# Altium schematic sheet UI_BUTTON_LED.SchDoc
size 297 x 209 mm
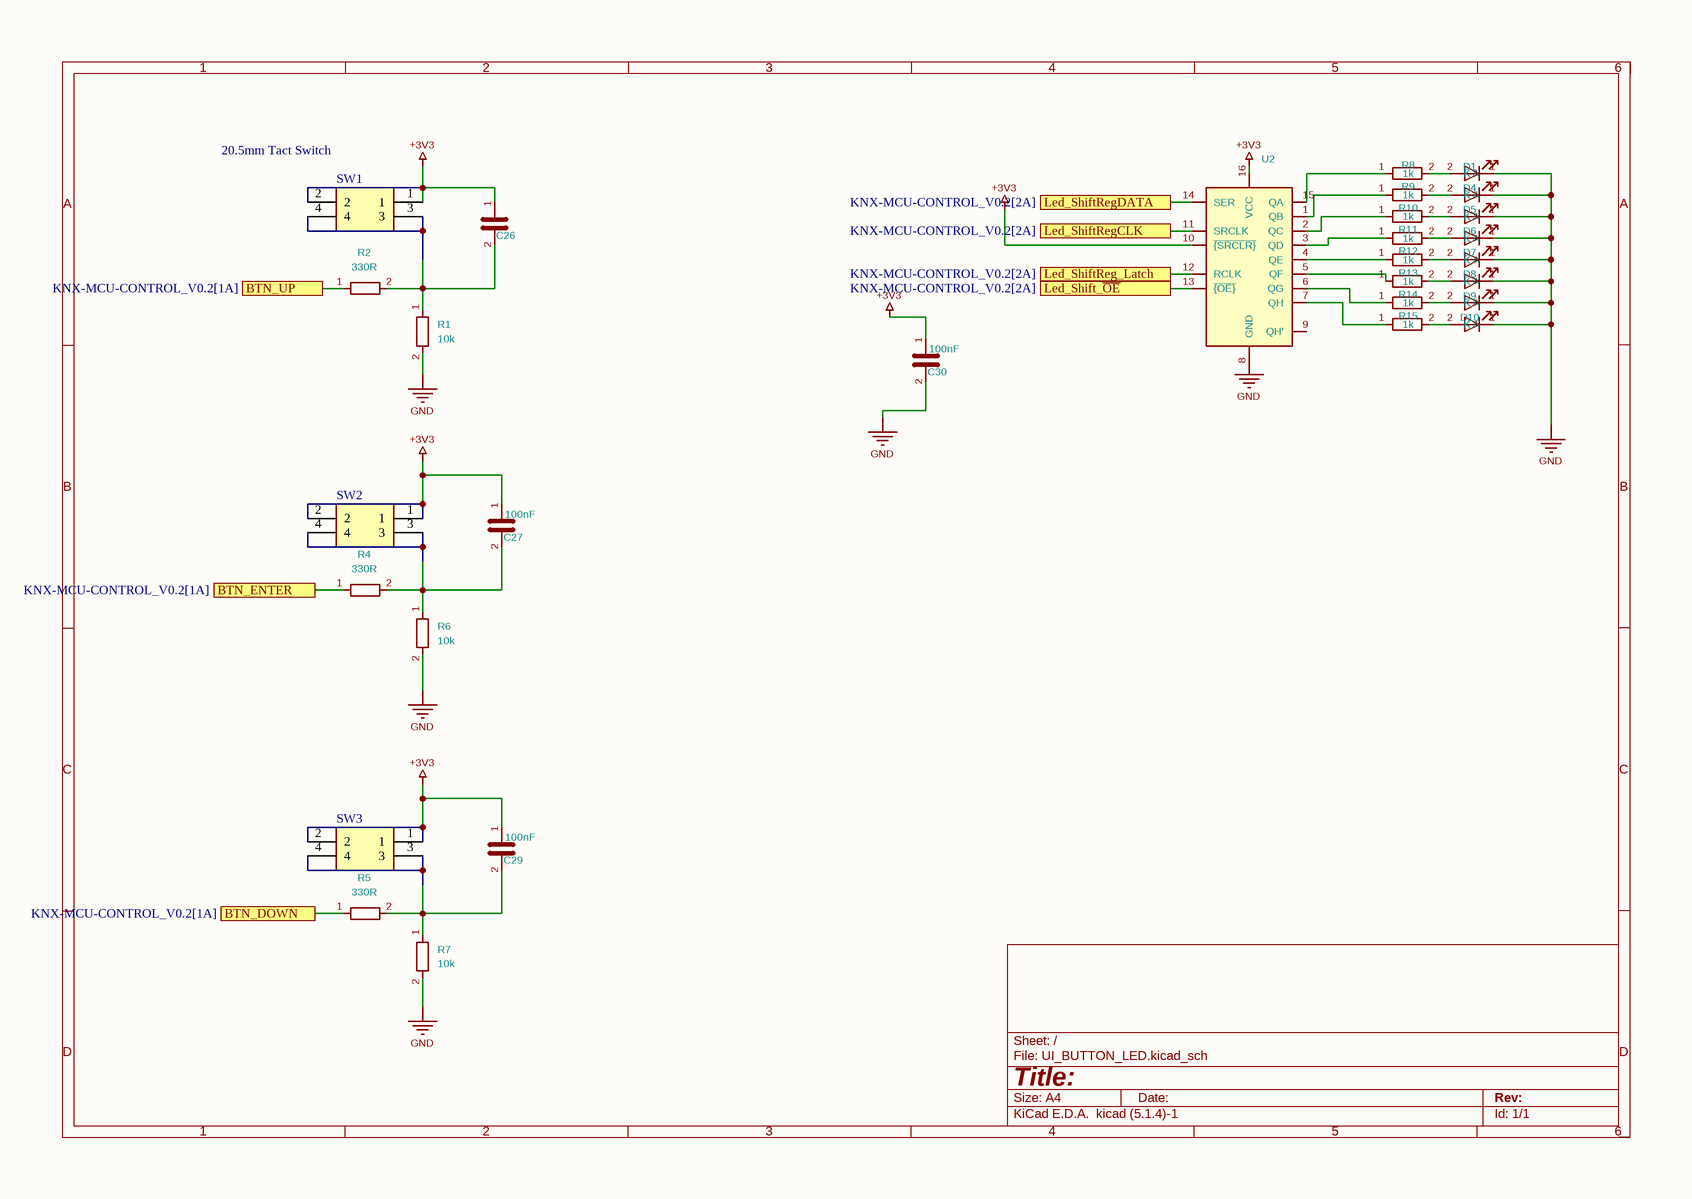
[diagram p0: UI_BUTTON_LED.SchDoc]

## Parts
C26  100nF  [C_0603_1608Metric]  (value not drawn)
C27  100nF  [C_0603_1608Metric]
C29  100nF  [C_0603_1608Metric]
C30  100nF  [C_0603_1608Metric]
D1  LED  [LED_0603_1608Metric]  (value not drawn)
D4  LED  [LED_0603_1608Metric]  (value not drawn)
D5  LED  [LED_0603_1608Metric]  (value not drawn)
D6  LED  [LED_0603_1608Metric]  (value not drawn)
D7  LED  [LED_0603_1608Metric]  (value not drawn)
D8  LED  [LED_0603_1608Metric]  (value not drawn)
D9  LED  [LED_0603_1608Metric]  (value not drawn)
D10  LED  [LED_0603_1608Metric]  (value not drawn)
R1  10k  [R_0603_1608Metric]
R2  330R  [R_0603_1608Metric]
R4  330R  [R_0603_1608Metric]
R5  330R  [R_0603_1608Metric]
R6  10k  [R_0603_1608Metric]
R7  10k  [R_0603_1608Metric]
R8  1k  [R_0603_1608Metric]
R9  1k  [R_0603_1608Metric]
R10  1k  [R_0603_1608Metric]
R11  1k  [R_0603_1608Metric]
R12  1k  [R_0603_1608Metric]
R13  1k  [R_0603_1608Metric]
R14  1k  [R_0603_1608Metric]
R15  1k  [R_0603_1608Metric]
SW1  TSA06141-225B532CA-3C00  [TL1105]  (value not drawn)
SW2  TSA06141-225B532CA-3C00  [TL1105]  (value not drawn)
SW3  TSA06141-225B532CA-3C00  [TL1105]  (value not drawn)
U2  74HC595PW,118  [TSSOP-16_4.4x5mm_P0.65mm]  (value not drawn)

## Ports
BTN_DOWN (see KNX-MCU-CONTROL_V0.2[1A]), BTN_ENTER (see KNX-MCU-CONTROL_V0.2[1A]), BTN_UP (see KNX-MCU-CONTROL_V0.2[1A]), Led_Shift_~{OE} (see KNX-MCU-CONTROL_V0.2[2A]), Led_ShiftReg_Latch (see KNX-MCU-CONTROL_V0.2[2A]), Led_ShiftRegCLK (see KNX-MCU-CONTROL_V0.2[2A]), Led_ShiftRegDATA (see KNX-MCU-CONTROL_V0.2[2A])

## Nets
+3V3: C26.1 C27.1 C29.1 C30.1 SW1.1 SW1.2 SW2.1 SW2.2 SW3.1 SW3.2 U2.10(~{{SRCLR}}) U2.16(VCC)
GND: C30.2 D1.1(K) D4.1(K) D5.1(K) D6.1(K) D7.1(K) D8.1(K) D9.1(K) D10.1(K) R1.2 R6.2 R7.2 U2.8(GND)
BTN_DOWN: R5.1 ; port BTN_DOWN
BTN_ENTER: R4.1 ; port BTN_ENTER
BTN_UP: R2.1 ; port BTN_UP
Led_Shift_~{OE}: U2.13(~{{OE}}) ; port Led_Shift_~{OE}
Led_ShiftReg_Latch: U2.12(RCLK) ; port Led_ShiftReg_Latch
Led_ShiftRegCLK: U2.11(SRCLK) ; port Led_ShiftRegCLK
Led_ShiftRegDATA: U2.14(SER) ; port Led_ShiftRegDATA
NetC26_2: C26.2 R1.1 R2.2 SW1.3 SW1.4
NetC27_2: C27.2 R4.2 R6.1 SW2.3 SW2.4
NetC29_2: C29.2 R5.2 R7.1 SW3.3 SW3.4
NetD1_2: D1.2(A) R8.2
NetD4_2: D4.2(A) R9.2
NetD5_2: D5.2(A) R10.2
NetD6_2: D6.2(A) R11.2
NetD7_2: D7.2(A) R12.2
NetD8_2: D8.2(A) R13.2
NetD9_2: D9.2(A) R14.2
NetD10_2: D10.2(A) R15.2
NetR8_1: R8.1 U2.15(QA)
NetR9_1: R9.1 U2.1(QB)
NetR10_1: R10.1 U2.2(QC)
NetR11_1: R11.1 U2.3(QD)
NetR12_1: R12.1 U2.4(QE)
NetR13_1: R13.1 U2.5(QF)
NetR14_1: R14.1 U2.6(QG)
NetR15_1: R15.1 U2.7(QH)

Not connected (* = marked no-connect by the designer): U2 9(QH')

## Notes on the sheet
- (near SW1) 20.5mm Tact Switch
- 1
- 2
- 3
- 4
- 5
- 6
- A
- B
- C
- D
- Title:
- File: UI_BUTTON_LED.kicad_sch
- Sheet: /
- KiCad E.D.A.  kicad (5.1.4)-1
- Size: A4
- Date:
- Rev:
- Id: 1/1

## Library data of the parts
C26 C27 C29 = C_3: Manufacturer Part Number: CC0603KRX7R9BB104; Manufacturer: YAGEO; Package: C_0603; Value: 100nF; Footprint: Capacitor_SMD:C_0603_1608Metric
C30 = C_1: Manufacturer Part Number: CC0603KRX7R9BB104; Manufacturer: YAGEO; Package: C_0603; Value: 100nF; Footprint: Capacitor_SMD:C_0603_1608Metric
D1 D4-D10 = LED: Manufacturer: LITEON; Manufacturer Part Number: LTST-C190KFKT-5A; Package: L_0603; Value: LED; Footprint: LED_SMD:LED_0603_1608Metric
R1 R6 R7 = R: Manufacturer: FOJAN; Manufacturer Part Number: FRC0603J103TS; Package: R_0603; Value: 10k; Footprint: Resistor_SMD:R_0603_1608Metric
R2 R4 R5 = R: Manufacturer: FOJAN; Manufacturer Part Number: FRC0603J331 TS; Package: R_0603; Value: 330R; Footprint: Resistor_SMD:R_0603_1608Metric
R8-R15 = R: Manufacturer: YAGEO; Manufacturer Part Number: RC0603JR-071KL; Package: R_0603; Value: 1k; Footprint: Resistor_SMD:R_0603_1608Metric
SW1-SW3 = TL1105BF160Q: Through Hole-4P,8.2x7.6mm; Manufacturer: Khon; Manufacturer Part Number: TSA06141-225B532CA-3C00
U2 = 74HC595: Manufacturer: Nexperia; Manufacturer Part Number: 74HC595PW,118; Package: TSSOP-16; Value: 74HC595PW,118; Footprint: Package_SO:TSSOP-16_4.4x5mm_P0.65mm